# Altium schematic sheet PowerBoardV2.SchDoc
size A4
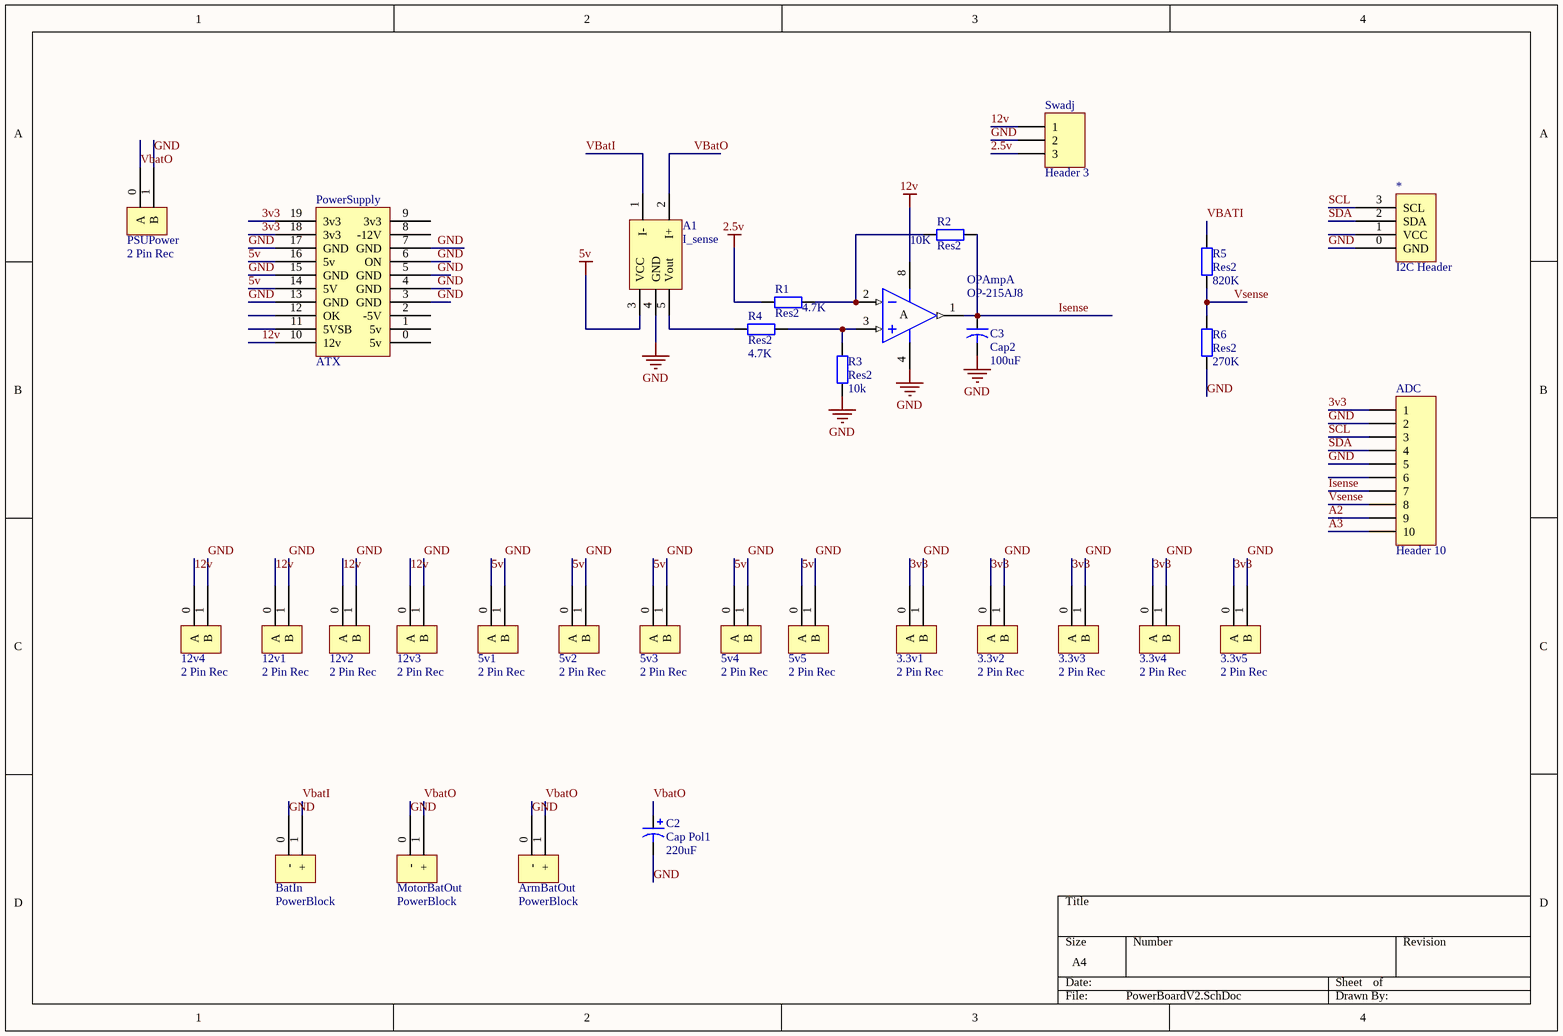
[diagram p0: PowerBoardV2.SchDoc]

## Parts
3.3v1  2 Pin Rec  [2 Pin Rec]
3.3v2  2 Pin Rec  [2 Pin Rec]
3.3v3  2 Pin Rec  [2 Pin Rec]
3.3v4  2 Pin Rec  [2 Pin Rec]
3.3v5  2 Pin Rec  [2 Pin Rec]
5v1  2 Pin Rec  [2 Pin Rec]
5v2  2 Pin Rec  [2 Pin Rec]
5v3  2 Pin Rec  [2 Pin Rec]
5v4  2 Pin Rec  [2 Pin Rec]
5v5  2 Pin Rec  [2 Pin Rec]
12v1  2 Pin Rec  [2 Pin Rec]
12v2  2 Pin Rec  [2 Pin Rec]
12v3  2 Pin Rec  [2 Pin Rec]
12v4  2 Pin Rec  [2 Pin Rec]
*  I2C Header  [I2C Header]
A1  I_sense  [CurrentSensor]
ADC  Header 10  [HDR1X10]
ArmBatOut  PowerBlock  [PowerBlock]
BatIn  PowerBlock  [PowerBlock]
C2  Cap Pol1  value 220uF  [RB7.6-15]
C3  Cap2  value 100uF  [CAPR5-4X5]
MotorBatOut  PowerBlock  [PowerBlock]
OPAmp  OP-215AJ8  [DIP-8]  (part A of 2)
PowerSupply  ATX  [ATX]
PSUPower  2 Pin Rec  [2 Pin Rec]
R1  Res2  value 4.7K  [AXIAL-0.4]
R2  Res2  value 10K  [AXIAL-0.4]
R3  Res2  value 10k  [AXIAL-0.4]
R4  Res2  value 4.7K  [AXIAL-0.4]
R5  Res2  value 820K  [AXIAL-0.4]
R6  Res2  value 270K  [AXIAL-0.4]
Swadj  Header 3  [HDR1X3]

## Nets
2.5v: R1.1 Swadj.3
5v: 5v1.0(A) 5v2.0(A) 5v3.0(A) 5v4.0(A) 5v5.0(A) A1.3(VCC) PowerSupply.14(5V) PowerSupply.16(5v)
12v: 12v1.0(A) 12v2.0(A) 12v3.0(A) 12v4.0(A) OPAmp.8(V+) PowerSupply.10(12v) Swadj.1
GND: 3.3v1.1(B) 3.3v2.1(B) 3.3v3.1(B) 3.3v4.1(B) 3.3v5.1(B) 5v1.1(B) 5v2.1(B) 5v3.1(B) 5v4.1(B) 5v5.1(B) 12v1.1(B) 12v2.1(B) 12v3.1(B) 12v4.1(B) *.0(GND) A1.4(GND) ADC.2 ADC.5 ArmBatOut.0(-) BatIn.0(-) C2.2 C3.2 MotorBatOut.0(-) OPAmp.4(V-) PowerSupply.3(GND) PowerSupply.4(GND) PowerSupply.5(GND) PowerSupply.6(ON) PowerSupply.7(GND) PowerSupply.13(GND) PowerSupply.15(GND) PowerSupply.17(GND) PSUPower.1(B) R3.1 R6.1 Swadj.2
3v3: 3.3v1.0(A) 3.3v2.0(A) 3.3v3.0(A) 3.3v4.0(A) 3.3v5.0(A) ADC.1 PowerSupply.18(3v3) PowerSupply.19(3v3)
A2: ADC.9
A3: ADC.10
Isense: ADC.7 C3.1 OPAmp.1(OUT) R2.2
SCL: *.3(SCL) ADC.3
SDA: *.2(SDA) ADC.4
VBatI: A1.1(I-) BatIn.1(+) R5.2
VBatO: A1.2(I+) ArmBatOut.1(+) C2.1 MotorBatOut.1(+) PSUPower.0(A)
Vsense: ADC.8 R5.1 R6.2
NetA1_5: A1.5(Vout) R4.1
NetOPAmp_2: OPAmp.2(IN-) R1.2 R2.1
NetOPAmp_3: OPAmp.3(IN+) R3.2 R4.2

Not connected (* = marked no-connect by the designer): * 1(VCC); ADC 6; PowerSupply 0(5v) 1(5v) 2(-5V) 8(-12V) 9(3v3) 11(5VSB) 12(OK)

## Notes on the sheet
- (in symbol OP-215AJ8, part A) A

## Library data of the parts
A1 = ACS758: Current Sensor
ADC = Header 10: Header, 10-Pin; LatestRevisionDate: 17-Jul-2002; LatestRevisionNote: Re-released for DXP Platform.; Publisher: Altium Limited
C2 = Cap Pol1: Polarized Capacitor (Radial); Published: 8-Jun-2000; LatestRevisionDate: 17-Jul-2002; LatestRevisionNote: Re-released for DXP Platform.; PackageReference: RB7.6-15; Publisher: Altium Limited; PackageDescription: Polarized Capacitor (Radial); 2 Leads
C3 = Cap2: Capacitor; Published: 23-Sep-2002; PackageReference: CAPR5-4X5; Publisher: Altium Limited; PackageDescription: Capacitor; 2 Leads
OPAmp = OP-215AJ8: Dual Precision JFET-Input Operational Amplifier; Note: 1882; Published: 8-Jun-2000; LatestRevisionDate: 29-May-2009; LatestRevisionNote: Component Body Added.; DatasheetVersion: 1990; PackageVersion: J8 0801; PackageReference: J8; Publisher: Altium Limited; PackageDescription: DIP, Ceramic, 8-Pin, Row Spacing 7.62 mm, Pitch 2.54 mm; ComponentLink1Description: Manufacturer Link; ComponentLink1URL: http://www.linear.com/; ComponentLink2Description: Datasheet; ComponentLink2URL: http://www.linear.com/pc/downloadDocument.do?navId=H0,C3,P1202,D3780
R1-R6 = Res2: Resistor; Published: 8-Jun-2000; LatestRevisionDate: 17-Jul-2002; LatestRevisionNote: Re-released for DXP Platform.; PackageReference: AXIAL-0.4; Publisher: Altium Limited; PackageDescription: Axial Device, Thru-Hole; 2 Leads; 0.4 in Pin Spacing
Swadj = Header 3: Header, 3-Pin; LatestRevisionDate: 17-Jul-2002; LatestRevisionNote: Re-released for DXP Platform.; Publisher: Altium Limited